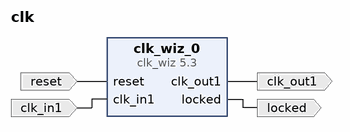
[diagram p0: block diagram of the top level]
# Vivado block design clk, Vivado 2016.1
create_bd_design clk

create_bd_port -dir I -type rst reset
set_property -dict {CONFIG.POLARITY ACTIVE_HIGH} [get_bd_ports reset]
create_bd_port -dir I -type clk clk_in1
create_bd_port -dir O -type clk clk_out1
create_bd_port -dir O locked

create_bd_cell -type ip -vlnv xilinx.com:ip:clk_wiz:5.3 clk_wiz_0
set_property -dict [list \
  CONFIG.CLKOUT1_REQUESTED_OUT_FREQ 25.000 \
  CONFIG.MMCM_DIVCLK_DIVIDE 1 \
  CONFIG.MMCM_CLKFBOUT_MULT_F 9.125 \
  CONFIG.MMCM_CLKOUT0_DIVIDE_F 36.500 \
  CONFIG.CLKOUT1_JITTER 181.828 \
  CONFIG.CLKOUT1_PHASE_ERROR 104.359 \
] [get_bd_cells clk_wiz_0]

# ---- connections ----

connect_bd_net [get_bd_ports reset] [get_bd_pins clk_wiz_0/reset]
connect_bd_net -net clk_in1_1 [get_bd_ports clk_in1] [get_bd_pins clk_wiz_0/clk_in1]
connect_bd_net [get_bd_pins clk_wiz_0/clk_out1] [get_bd_ports clk_out1]
connect_bd_net [get_bd_pins clk_wiz_0/locked] [get_bd_ports locked]

validate_bd_design
save_bd_design
